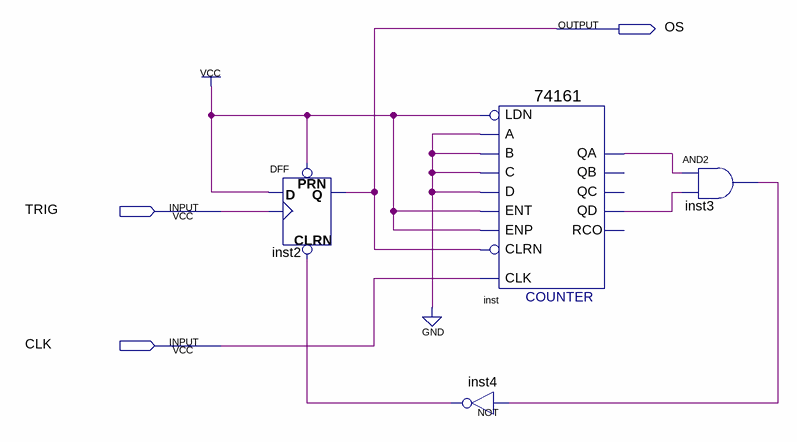
[diagram p0: schematic sheet]
// Quartus schematic oneshot8.bdf as structural Verilog: 4 symbols, 3 pins
module oneshot8 (
  input  TRIG,
  input  CLK,
  output OS
);

  wire inst3_out, inst4_out, inst_qa, inst_qd;

  DFF inst2 (.CLRN(inst4_out), .CLK(TRIG), .D(1'b1), .PRN(1'b1), .Q(OS));
  \74161  inst (
    .CLRN(OS), .CLK(CLK), .ENP(1'b1), .LDN(1'b1), .A(1'b0), .D(1'b0), .ENT(1'b1), .B(1'b0), .C(1'b0),
    .QD(inst_qd), .QA(inst_qa));  // open: QC, QB, RCO
  not inst4 (inst4_out, inst3_out);
  and inst3 (inst3_out, inst_qa, inst_qd);
endmodule
